# Altium schematic sheet Bluetooth.SchDoc
size A; SheetNumber: 2; SheetTotal: 6
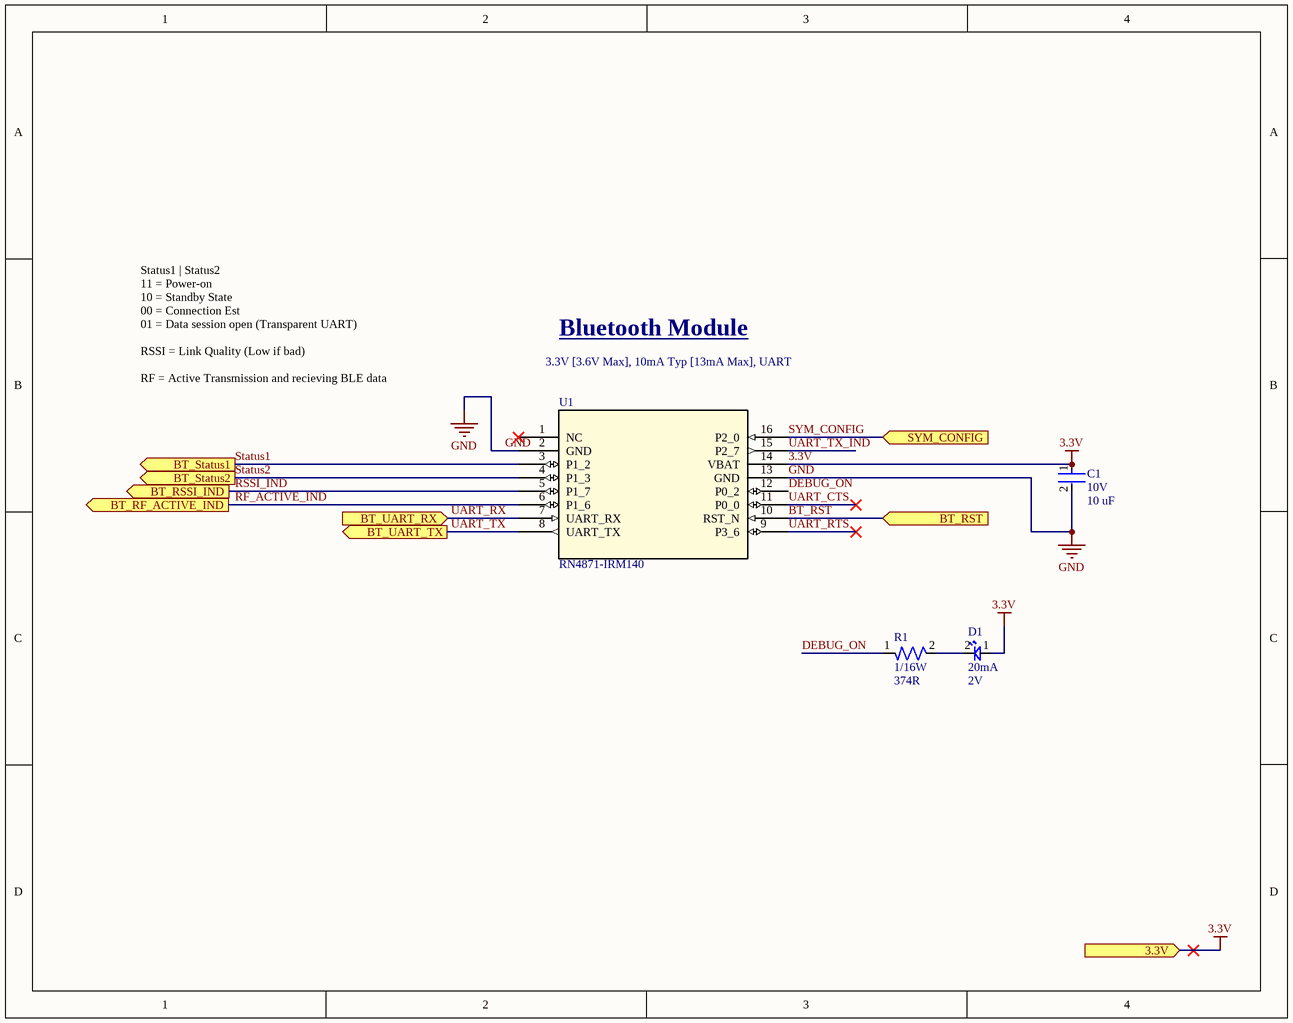
[diagram p0: Bluetooth.SchDoc]

## Parts
C1  Voltage: 10V  Capacitance: 10 uF  [CAP-0603]  (hidden comment: CC0603KRX5R6BB106)
D1  Current Rating: 20mA  Vf: 2V  [LED-0603]  (hidden comment: 150060AS75000)
R1  Power: 1/16W  Resistance: 374R  [RES-0402]  (hidden comment: RC0402FR-07374RL)
U1  RN4871-IRM140  [RN4871_MCH]

## Ports
3.3V (in, see TLD[3B], Connectors[4D], LDOs[1A], MCU[4D]), BT_RF_ACTIVE_IND (out, see TLD[4B], MCU[1B]), BT_RSSI_IND (out, see TLD[4B], MCU[1B]), BT_RST (in, see TLD[3B], MCU[1C]), BT_Status1 (out, see TLD[4B], MCU[1B]), BT_Status2 (out, see TLD[4B]), BT_UART_RX (in, see TLD[3B]), BT_UART_TX (out, see TLD[4B]), SYM_CONFIG (in, see TLD[3B])

## Nets
3.3V: C1.1 D1.1 U1.14(VBAT) ; port 3.3V
GND: C1.2 U1.2(GND) U1.13(GND)
BT_RST: U1.10(RST_N) ; port BT_RST
DEBUG_ON: R1.1 U1.12(P0_2)
RF_ACTIVE_IND: U1.6(P1_6) ; port BT_RF_ACTIVE_IND
RSSI_IND: U1.5(P1_7) ; port BT_RSSI_IND
Status1: U1.3(P1_2) ; port BT_Status1
Status2: U1.4(P1_3) ; port BT_Status2
SYM_CONFIG: U1.16(P2_0) ; port SYM_CONFIG
UART_CTS: U1.11(P0_0)
UART_RTS: U1.9(P3_6)
UART_RX: U1.7(UART_RX) ; port BT_UART_RX
UART_TX: U1.8(UART_TX) ; port BT_UART_TX
UART_TX_IND: U1.15(P2_7)
NetD1_2: D1.2 R1.2

Not connected (* = marked no-connect by the designer): U1 1(NC)*

## Notes on the sheet
- 3.3V [3.6V Max], 10mA Typ [13mA Max], UART
- Bluetooth Module
- Status1 | Status2
  11 = Power-on
  10 = Standby State
  00 = Connection Est
  01 = Data session open (Transparent UART)
  RSSI = Link Quality (Low if bad)
  RF = Active Transmission and recieving BLE data

## Library data of the parts
C1 = CAP-10U-0001: CAP CER 10UF 10V X5R 0603; ComponentLink1Description: Datasheet; ComponentLink1URL: https://www.yageo.com/upload/media/product/app/datasheet/mlcc/upy-gphc_x5r_4v-to-50v.pdf; Device Class: Ceramic; Size: 0603
D1 = LED_Amber_0001: CAP CER 0.1UF 100V X7R 0603; Manufacturer: Wurth Electronik; Assembled?: no; Color: Amber; Manufacturer Part Number: 150060AS75000; Package Size: 0603
R1 = RES-374-0001: RES 374 OHM 1% 1/16W 0402; Tolerance: 1%; Size: 0402; ComponentLink1Description: Datasheet; ComponentLink1URL: https://www.yageo.com/upload/media/product/products/datasheet/rchip/PYu-RC_Group_51_RoHS_L_12.pdf
U1 = IC-Bluetooth-2: Bluetooth Bluetooth v5.0 Transceiver Module 2.402GHz ~ 2.48GHz Integrated, Chip Surface Mount; Mfr_Name: Microchip; RefDes: RefDes; Type: Type; ComponentLink1Description: Datasheet; ComponentLink1URL: https://ww1.microchip.com/downloads/aemDocuments/documents/WSG/ProductDocuments/DataSheets/RN4870-71-Bluetooth-Low-Energy-Module-DS50002489.pdf